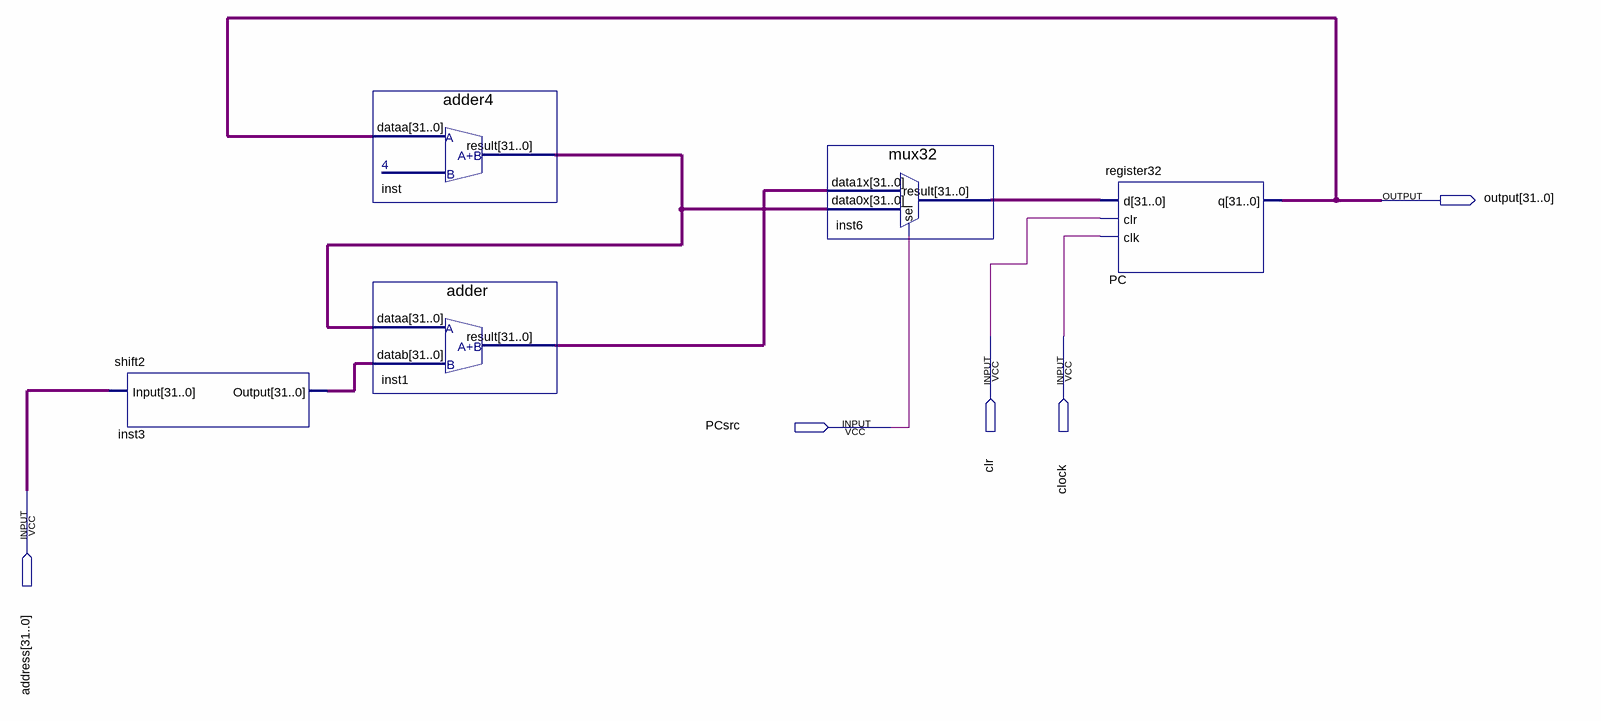
[diagram p0: schematic sheet]
// Quartus schematic FetchingInstructionUnit.bdf as structural Verilog: 5 symbols, 5 pins
module FetchingInstructionUnit (
  input  clr,
  input  clock,
  input  PCsrc,
  input  [31:0] address,
  output [31:0] \output 
);

  wire [31:0] inst1_result, inst3_output, inst6_result, inst_result;

  shift2 inst3 (.Input(address), .Output(inst3_output));
  adder4 inst (.dataa(\output ), .result(inst_result));
  adder inst1 (.dataa(inst_result), .datab(inst3_output), .result(inst1_result));
  mux32 inst6 (.data1x(inst1_result), .data0x(inst_result), .sel(PCsrc), .result(inst6_result));
  register32 PC (.d(inst6_result), .clr(clr), .clk(clock), .q(\output ));
endmodule
